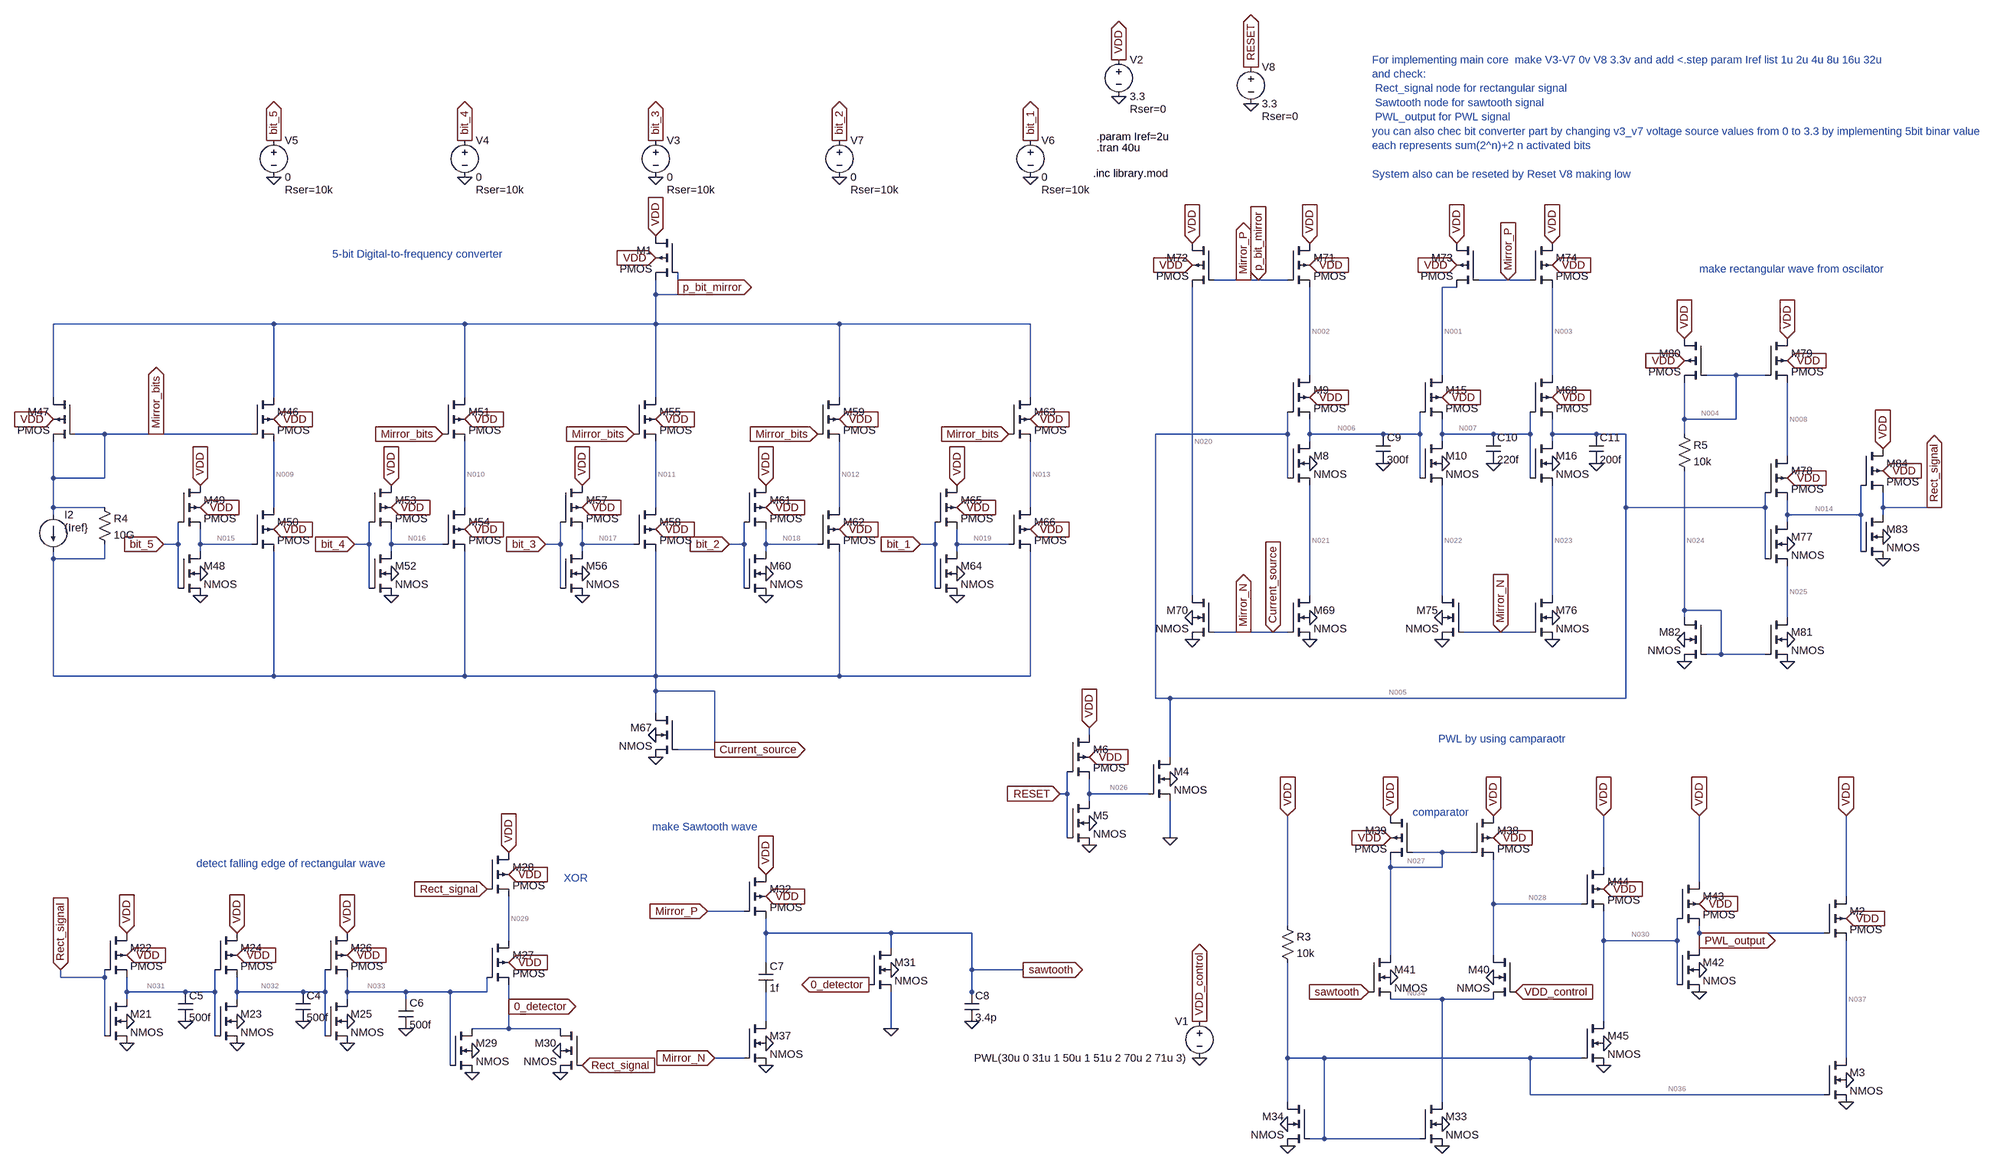
[diagram p0: schematic final_pwl_ready_with_5_bit_converter_with_reset.asc]
final_pwl_ready_with_5_bit_converter_with_reset.asc, the LTspice schematic file:
Version 4
SHEET 1 4352 2900
WIRE -288 288 -352 288
WIRE -256 288 -288 288
WIRE -192 288 -256 288
WIRE 288 288 224 288
WIRE 336 288 288 288
WIRE -1520 304 -1520 272
WIRE 176 304 144 304
WIRE -1568 320 -1568 288
WIRE -1520 320 -1520 304
WIRE -1520 320 -1568 320
WIRE -2400 384 -2880 384
WIRE -1984 384 -2400 384
WIRE -1568 384 -1568 320
WIRE -1568 384 -1984 384
WIRE -1168 384 -1568 384
WIRE -752 384 -1168 384
WIRE -144 496 -144 304
WIRE 144 496 144 304
WIRE 384 496 384 304
WIRE 784 496 720 496
WIRE 848 496 784 496
WIRE -2880 544 -2880 384
WIRE -2400 544 -2400 384
WIRE -1984 544 -1984 384
WIRE -1568 544 -1568 384
WIRE -1168 544 -1168 384
WIRE -752 544 -752 384
WIRE 672 592 672 512
WIRE 784 592 784 496
WIRE 784 592 672 592
WIRE -2768 624 -2832 624
WIRE -2656 624 -2768 624
WIRE -2448 624 -2656 624
WIRE -192 624 -192 576
WIRE -192 624 -480 624
WIRE -144 624 -144 592
WIRE 16 624 -144 624
WIRE 96 624 96 576
WIRE 96 624 16 624
WIRE 144 624 144 592
WIRE 256 624 144 624
WIRE 336 624 336 576
WIRE 336 624 256 624
WIRE 384 624 384 592
WIRE 480 624 384 624
WIRE 544 624 480 624
WIRE 672 624 672 592
WIRE -144 640 -144 624
WIRE 144 640 144 624
WIRE 384 640 384 624
WIRE 896 672 896 512
WIRE -2880 720 -2880 640
WIRE -2768 720 -2768 624
WIRE -2768 720 -2880 720
WIRE -192 720 -192 624
WIRE 96 720 96 624
WIRE 336 720 336 624
WIRE -2880 784 -2880 720
WIRE -2768 784 -2880 784
WIRE -2400 784 -2400 640
WIRE -1984 784 -1984 640
WIRE -1568 784 -1568 640
WIRE -1168 784 -1168 640
WIRE -752 784 -752 640
WIRE 544 784 544 624
WIRE 848 784 848 752
WIRE 848 784 544 784
WIRE 1104 784 1104 752
WIRE 1216 784 1104 784
WIRE 1232 784 1216 784
WIRE -2880 800 -2880 784
WIRE 896 800 896 768
WIRE 1056 800 1056 736
WIRE 1056 800 896 800
WIRE 1104 800 1104 784
WIRE 896 816 896 800
WIRE -2608 864 -2608 816
WIRE -2608 864 -2640 864
WIRE -2560 864 -2560 832
WIRE -2448 864 -2560 864
WIRE -2192 864 -2192 816
WIRE -2192 864 -2224 864
WIRE -2144 864 -2144 832
WIRE -2032 864 -2144 864
WIRE -1776 864 -1776 816
WIRE -1776 864 -1808 864
WIRE -1728 864 -1728 832
WIRE -1616 864 -1728 864
WIRE -1376 864 -1376 816
WIRE -1376 864 -1408 864
WIRE -1328 864 -1328 832
WIRE -1216 864 -1328 864
WIRE -960 864 -960 816
WIRE -960 864 -992 864
WIRE -912 864 -912 832
WIRE -800 864 -912 864
WIRE -2560 880 -2560 864
WIRE -2144 880 -2144 864
WIRE -1728 880 -1728 864
WIRE -1328 880 -1328 864
WIRE -912 880 -912 864
WIRE 1056 880 1056 800
WIRE -2880 896 -2880 880
WIRE -2768 896 -2768 864
WIRE -2768 896 -2880 896
WIRE 848 896 848 784
WIRE -2608 960 -2608 864
WIRE -2192 960 -2192 864
WIRE -1776 960 -1776 864
WIRE -1376 960 -1376 864
WIRE -960 960 -960 864
WIRE -400 976 -400 304
WIRE -144 976 -144 736
WIRE 144 976 144 736
WIRE 384 976 384 736
WIRE 672 1008 672 704
WIRE 752 1008 672 1008
WIRE 672 1024 672 1008
WIRE 896 1024 896 912
WIRE -288 1056 -352 1056
WIRE -224 1056 -288 1056
WIRE -192 1056 -224 1056
WIRE 272 1056 192 1056
WIRE 336 1056 272 1056
WIRE 752 1104 752 1008
WIRE 752 1104 720 1104
WIRE 848 1104 752 1104
WIRE -2880 1152 -2880 896
WIRE -2400 1152 -2400 880
WIRE -2400 1152 -2880 1152
WIRE -1984 1152 -1984 880
WIRE -1984 1152 -2400 1152
WIRE -1568 1152 -1568 880
WIRE -1568 1152 -1984 1152
WIRE -1168 1152 -1168 880
WIRE -1168 1152 -1568 1152
WIRE -752 1152 -752 880
WIRE -752 1152 -1168 1152
WIRE -1568 1184 -1568 1152
WIRE -1440 1184 -1568 1184
WIRE -480 1200 -480 624
WIRE -448 1200 -480 1200
WIRE 544 1200 544 784
WIRE 544 1200 -448 1200
WIRE -1568 1232 -1568 1184
WIRE -624 1280 -624 1264
WIRE -1440 1312 -1440 1184
WIRE -1440 1312 -1520 1312
WIRE -448 1328 -448 1200
WIRE -672 1408 -672 1360
WIRE -672 1408 -688 1408
WIRE -624 1408 -624 1376
WIRE -496 1408 -624 1408
WIRE -624 1424 -624 1408
WIRE -672 1504 -672 1408
WIRE -448 1504 -448 1424
WIRE 144 1536 80 1536
WIRE 208 1536 144 1536
WIRE 32 1568 32 1552
WIRE 144 1568 144 1536
WIRE 144 1568 32 1568
WIRE 496 1568 496 1456
WIRE 704 1600 704 1456
WIRE 1024 1632 1024 1456
WIRE 256 1648 256 1552
WIRE 448 1648 256 1648
WIRE -1376 1664 -1456 1664
WIRE -192 1696 -192 1456
WIRE -1328 1712 -1328 1680
WIRE -1056 1712 -1328 1712
WIRE -880 1712 -1056 1712
WIRE 704 1712 704 1696
WIRE 976 1712 704 1712
WIRE -1888 1728 -1888 1632
WIRE 496 1728 496 1664
WIRE 656 1728 656 1680
WIRE 656 1728 496 1728
WIRE 704 1728 704 1712
WIRE -1056 1744 -1056 1712
WIRE 704 1744 704 1728
WIRE 32 1760 32 1568
WIRE 256 1760 256 1648
WIRE -1328 1776 -1328 1712
WIRE -880 1792 -880 1712
WIRE -768 1792 -880 1792
WIRE -2864 1808 -2864 1792
WIRE -2768 1808 -2768 1792
WIRE -2768 1808 -2864 1808
WIRE 656 1824 656 1728
WIRE -2720 1840 -2720 1808
WIRE -2592 1840 -2720 1840
WIRE -2528 1840 -2528 1792
WIRE -2528 1840 -2592 1840
WIRE -2480 1840 -2480 1808
WIRE -2336 1840 -2480 1840
WIRE -2288 1840 -2288 1792
WIRE -2288 1840 -2336 1840
WIRE -2240 1840 -2240 1808
WIRE -2112 1840 -2240 1840
WIRE -2016 1840 -2112 1840
WIRE -1936 1840 -1936 1808
WIRE -1936 1840 -2016 1840
WIRE -880 1840 -880 1792
WIRE -2720 1856 -2720 1840
WIRE -2480 1856 -2480 1840
WIRE -2240 1856 -2240 1840
WIRE -2112 1856 -2112 1840
WIRE -880 1856 -880 1840
WIRE 144 1856 32 1856
WIRE 256 1856 144 1856
WIRE -1888 1872 -1888 1824
WIRE -1328 1904 -1328 1840
WIRE 496 1904 496 1728
WIRE -1888 1920 -1888 1872
WIRE -1888 1920 -1968 1920
WIRE -1776 1920 -1888 1920
WIRE -1056 1920 -1056 1840
WIRE -2768 1936 -2768 1808
WIRE -2528 1936 -2528 1840
WIRE -2288 1936 -2288 1840
WIRE -1376 1984 -1440 1984
WIRE -192 1984 -192 1776
WIRE -112 1984 -192 1984
WIRE 336 1984 -112 1984
WIRE 448 1984 336 1984
WIRE 1024 1984 1024 1728
WIRE -2016 2000 -2016 1840
WIRE 336 2064 336 1984
WIRE 976 2064 336 2064
WIRE -192 2080 -192 1984
WIRE 144 2080 144 1856
WIRE -112 2160 -112 1984
WIRE -112 2160 -144 2160
WIRE 96 2160 -112 2160
FLAG -560 -112 0
FLAG -560 -192 VDD
IOPIN -560 -192 Out
FLAG -2720 1904 0
FLAG -2480 1904 0
FLAG -2240 1904 0
FLAG -2240 1760 VDD
IOPIN -2240 1760 In
FLAG -2480 1760 VDD
IOPIN -2480 1760 In
FLAG -2720 1760 VDD
IOPIN -2720 1760 In
FLAG -2864 1792 Rect_signal
IOPIN -2864 1792 In
FLAG -2240 1952 0
FLAG -2480 1952 0
FLAG -2720 1952 0
FLAG -2720 1712 VDD
IOPIN -2720 1712 In
FLAG -2480 1712 VDD
IOPIN -2480 1712 In
FLAG -2240 1712 VDD
IOPIN -2240 1712 In
FLAG -2112 1920 0
FLAG -2336 1904 0
FLAG -2592 1904 0
FLAG -1936 1616 Rect_signal
IOPIN -1936 1616 In
FLAG -1968 1968 0
FLAG -1776 1968 0
FLAG -1776 2016 0
FLAG -1888 1584 VDD
IOPIN -1888 1584 In
FLAG -1888 1536 VDD
IOPIN -1888 1536 In
FLAG -1728 2000 Rect_signal
IOPIN -1728 2000 In
FLAG -1888 1776 VDD
IOPIN -1888 1776 In
FLAG -1968 2016 0
FLAG -1888 1872 0_detector
IOPIN -1888 1872 Out
FLAG -1104 1824 0_detector
IOPIN -1104 1824 Out
FLAG -1328 1584 VDD
IOPIN -1328 1584 In
FLAG -1328 1632 VDD
IOPIN -1328 1632 In
FLAG -1056 1920 0
FLAG -880 1904 0
FLAG -1056 1792 0
FLAG -768 1792 sawtooth
IOPIN -768 1792 Out
FLAG -1328 2000 0
FLAG -1328 1952 0
FLAG -1440 1984 Mirror_N
IOPIN -1440 1984 In
FLAG -1456 1664 Mirror_P
IOPIN -1456 1664 In
FLAG -16 1840 sawtooth
IOPIN -16 1840 In
FLAG -384 1984 0
FLAG 32 1456 VDD
IOPIN 32 1456 In
FLAG 256 1456 VDD
IOPIN 256 1456 In
FLAG 256 1504 VDD
IOPIN 256 1504 In
FLAG 32 1504 VDD
IOPIN 32 1504 In
FLAG 256 1808 0
FLAG 32 1808 0
FLAG -192 1456 VDD
IOPIN -192 1456 In
FLAG -192 2176 0
FLAG -192 2128 0
FLAG 144 2176 0
FLAG 144 2128 0
FLAG -384 1904 VDD_control
IOPIN -384 1904 Out
FLAG 304 1840 VDD_control
IOPIN 304 1840 In
FLAG 496 1456 VDD
IOPIN 496 1456 In
FLAG 496 1616 VDD
IOPIN 496 1616 In
FLAG 496 2000 0
FLAG 496 1952 0
FLAG 704 1792 0
FLAG 704 1648 VDD
IOPIN 704 1648 In
FLAG 704 1456 VDD
IOPIN 704 1456 In
FLAG 704 1840 0
FLAG 704 1728 PWL_output
IOPIN 704 1728 Out
FLAG -752 -16 bit_1
IOPIN -752 -16 Out
FLAG -1168 -16 bit_2
IOPIN -1168 -16 Out
FLAG -1568 -16 bit_3
IOPIN -1568 -16 Out
FLAG -1984 -16 bit_4
IOPIN -1984 -16 Out
FLAG -2400 -16 bit_5
IOPIN -2400 -16 Out
FLAG -752 64 0
FLAG -1168 64 0
FLAG -1568 64 0
FLAG -1984 64 0
FLAG -2400 64 0
FLAG -2400 592 VDD
IOPIN -2400 592 In
FLAG -2880 592 VDD
IOPIN -2880 592 In
FLAG -2560 928 0
FLAG -2560 784 VDD
IOPIN -2560 784 In
FLAG -2560 736 VDD
IOPIN -2560 736 In
FLAG -2560 976 0
FLAG -2400 832 VDD
IOPIN -2400 832 In
FLAG -2640 864 bit_5
IOPIN -2640 864 In
FLAG -1984 592 VDD
IOPIN -1984 592 In
FLAG -2144 928 0
FLAG -2144 784 VDD
IOPIN -2144 784 In
FLAG -2144 736 VDD
IOPIN -2144 736 In
FLAG -2144 976 0
FLAG -1984 832 VDD
IOPIN -1984 832 In
FLAG -2224 864 bit_4
IOPIN -2224 864 In
FLAG -1568 592 VDD
IOPIN -1568 592 In
FLAG -1728 928 0
FLAG -1728 784 VDD
IOPIN -1728 784 In
FLAG -1728 736 VDD
IOPIN -1728 736 In
FLAG -1728 976 0
FLAG -1568 832 VDD
IOPIN -1568 832 In
FLAG -1808 864 bit_3
IOPIN -1808 864 In
FLAG -1168 592 VDD
IOPIN -1168 592 In
FLAG -1328 928 0
FLAG -1328 784 VDD
IOPIN -1328 784 In
FLAG -1328 736 VDD
IOPIN -1328 736 In
FLAG -1328 976 0
FLAG -1168 832 VDD
IOPIN -1168 832 In
FLAG -1408 864 bit_2
IOPIN -1408 864 In
FLAG -752 592 VDD
IOPIN -752 592 In
FLAG -912 928 0
FLAG -912 784 VDD
IOPIN -912 784 In
FLAG -912 736 VDD
IOPIN -912 736 In
FLAG -912 976 0
FLAG -752 832 VDD
IOPIN -752 832 In
FLAG -992 864 bit_1
IOPIN -992 864 In
FLAG -2656 624 Mirror_bits
IOPIN -2656 624 Out
FLAG -2032 624 Mirror_bits
IOPIN -2032 624 In
FLAG -1616 624 Mirror_bits
IOPIN -1616 624 In
FLAG -1216 624 Mirror_bits
IOPIN -1216 624 In
FLAG -800 624 Mirror_bits
IOPIN -800 624 In
FLAG -1568 1280 0
FLAG -1568 1328 0
FLAG -1440 1312 Current_source
IOPIN -1440 1312 Out
FLAG -144 688 0
FLAG 144 688 0
FLAG 384 688 0
FLAG -400 1072 0
FLAG -144 1072 0
FLAG -144 1024 0
FLAG -400 1024 0
FLAG 384 544 VDD
IOPIN 384 544 In
FLAG 144 544 VDD
IOPIN 144 544 In
FLAG -400 208 VDD
IOPIN -400 208 In
FLAG -144 208 VDD
IOPIN -144 208 In
FLAG -144 256 VDD
IOPIN -144 256 In
FLAG -400 256 VDD
IOPIN -400 256 In
FLAG -144 544 VDD
IOPIN -144 544 In
FLAG 176 208 VDD
IOPIN 176 208 In
FLAG 176 256 VDD
IOPIN 176 256 In
FLAG 384 208 VDD
IOPIN 384 208 In
FLAG 384 256 VDD
IOPIN 384 256 In
FLAG 144 1072 0
FLAG 144 1024 0
FLAG 384 1072 0
FLAG 384 1024 0
FLAG -288 288 Mirror_P
IOPIN -288 288 Out
FLAG -288 1056 Mirror_N
IOPIN -288 1056 Out
FLAG 288 288 Mirror_P
IOPIN 288 288 In
FLAG 272 1056 Mirror_N
IOPIN 272 1056 In
FLAG 896 864 0
FLAG 896 720 VDD
IOPIN 896 720 In
FLAG 672 416 VDD
IOPIN 672 416 In
FLAG 896 416 VDD
IOPIN 896 416 In
FLAG 896 464 VDD
IOPIN 896 464 In
FLAG 672 464 VDD
IOPIN 672 464 In
FLAG 672 1120 0
FLAG 896 1120 0
FLAG 896 1072 0
FLAG 672 1072 0
FLAG 1104 848 0
FLAG 1104 704 VDD
IOPIN 1104 704 In
FLAG 1104 656 VDD
IOPIN 1104 656 In
FLAG 1104 896 0
FLAG 16 688 0
FLAG 480 688 0
FLAG 256 688 0
FLAG 1216 784 Rect_signal
IOPIN 1216 784 Out
FLAG -1568 192 VDD
IOPIN -1568 192 In
FLAG -1568 240 VDD
IOPIN -1568 240 In
FLAG -1520 304 p_bit_mirror
IOPIN -1520 304 Out
FLAG -256 288 p_bit_mirror
IOPIN -256 288 In
FLAG -224 1056 Current_source
IOPIN -224 1056 In
FLAG 1024 1456 VDD
IOPIN 1024 1456 In
FLAG 1024 1680 VDD
IOPIN 1024 1680 In
FLAG 1024 2080 0
FLAG 1024 2032 0
FLAG -272 -96 0
FLAG -272 -176 RESET
IOPIN -272 -176 Out
FLAG -688 1408 RESET
IOPIN -688 1408 In
FLAG -448 1504 0
FLAG -624 1472 0
FLAG -624 1328 VDD
IOPIN -624 1328 In
FLAG -624 1264 VDD
IOPIN -624 1264 In
FLAG -624 1520 0
FLAG -448 1376 0
SYMBOL voltage -560 -208 R0
WINDOW 123 0 0 Left 0
WINDOW 39 24 124 Left 2
SYMATTR SpiceLine Rser=0
SYMATTR InstName V2
SYMATTR Value 3.3
SYMBOL nmos4 -2768 1856 R0
SYMATTR InstName M21
SYMATTR Value2 l=0.35u w=0.4u
SYMBOL pmos4 -2768 1712 R0
SYMATTR InstName M22
SYMATTR Value2 l=0.35u w=0.8u
SYMBOL nmos4 -2528 1856 R0
SYMATTR InstName M23
SYMATTR Value2 l=1.05u w=1.2u
SYMBOL pmos4 -2528 1712 R0
SYMATTR InstName M24
SYMATTR Value2 l=1.05u w=2.4u
SYMBOL nmos4 -2288 1856 R0
SYMATTR InstName M25
SYMATTR Value2 l=3.15u w=3.6u
SYMBOL pmos4 -2288 1712 R0
SYMATTR InstName M26
SYMATTR Value2 l=3.15u w=7.2u
SYMBOL cap -2352 1840 R0
SYMATTR InstName C4
SYMATTR Value 500f
SYMBOL cap -2608 1840 R0
SYMATTR InstName C5
SYMATTR Value 500f
SYMBOL cap -2128 1856 R0
SYMATTR InstName C6
SYMATTR Value 500f
SYMBOL pmos4 -1936 1728 R0
SYMATTR InstName M27
SYMATTR Value2 l=0.35u w=0.8u
SYMBOL pmos4 -1936 1536 R0
SYMATTR InstName M28
SYMATTR Value2 l=0.35u w=0.8u
SYMBOL nmos4 -2016 1920 R0
SYMATTR InstName M29
SYMATTR Value2 l=0.35u w=0.4u
SYMBOL nmos4 -1728 1920 M0
SYMATTR InstName M30
SYMATTR Value2 l=0.35u w=0.4u
SYMBOL pmos4 -1376 1584 R0
SYMATTR InstName M32
SYMATTR Value2 l=2u w=80u
SYMBOL cap -1344 1776 R0
SYMATTR InstName C7
SYMATTR Value 1f
SYMBOL cap -896 1840 R0
SYMATTR InstName C8
SYMATTR Value 3.4p
SYMBOL nmos4 -1104 1744 R0
SYMATTR InstName M31
SYMATTR Value2 l=0.35u w=15u
SYMBOL nmos4 -1376 1904 R0
SYMATTR InstName M37
SYMATTR Value2 l=2u w=40u
SYMBOL voltage -384 1888 M0
WINDOW 123 0 0 Left 0
WINDOW 39 0 0 Left 0
SYMATTR InstName V1
SYMATTR Value PWL(30u 0 31u 1 50u 1 51u 2 70u 2 71u 3)
SYMBOL pmos4 208 1456 R0
SYMATTR InstName M38
SYMATTR Value2 l=0.35u w=2.8u
SYMBOL pmos4 80 1456 M0
SYMATTR InstName M39
SYMATTR Value2 l=0.35u w=2.8u
SYMBOL nmos4 304 1760 M0
SYMATTR InstName M40
SYMATTR Value2 l=0.35u w=1.4u
SYMBOL nmos4 -16 1760 R0
SYMATTR InstName M41
SYMATTR Value2 l=0.35u w=1.4u
SYMBOL nmos4 -144 2080 M0
SYMATTR InstName M34
SYMATTR Value2 l=0.35u w=1.4u
SYMBOL res -208 1680 R0
SYMATTR InstName R3
SYMATTR Value 10k
SYMBOL nmos4 96 2080 R0
SYMATTR InstName M33
SYMATTR Value2 l=0.35u w=3u
SYMBOL pmos4 448 1568 R0
SYMATTR InstName M44
SYMATTR Value2 l=0.35u w=2.8u
SYMBOL nmos4 448 1904 R0
SYMATTR InstName M45
SYMATTR Value2 l=0.35u w=1.4u
SYMBOL nmos4 656 1744 R0
SYMATTR InstName M42
SYMATTR Value2 l=0.35u w=1u
SYMBOL pmos4 656 1600 R0
SYMATTR InstName M43
SYMATTR Value2 l=0.35u w=2.4u
SYMBOL voltage -752 -32 R0
WINDOW 123 0 0 Left 0
WINDOW 39 24 124 Left 2
SYMATTR SpiceLine Rser=10k
SYMATTR InstName V6
SYMATTR Value 0
SYMBOL voltage -1168 -32 R0
WINDOW 123 0 0 Left 0
WINDOW 39 24 124 Left 2
SYMATTR SpiceLine Rser=10k
SYMATTR InstName V7
SYMATTR Value 0
SYMBOL voltage -1568 -32 R0
WINDOW 123 0 0 Left 0
WINDOW 39 24 124 Left 2
SYMATTR SpiceLine Rser=10k
SYMATTR InstName V3
SYMATTR Value 0
SYMBOL voltage -1984 -32 R0
WINDOW 123 0 0 Left 0
WINDOW 39 24 124 Left 2
SYMATTR SpiceLine Rser=10k
SYMATTR InstName V4
SYMATTR Value 0
SYMBOL voltage -2400 -32 R0
WINDOW 123 0 0 Left 0
WINDOW 39 24 124 Left 2
SYMATTR SpiceLine Rser=10k
SYMATTR InstName V5
SYMATTR Value 0
SYMBOL current -2880 800 R0
WINDOW 123 0 0 Left 0
WINDOW 39 0 0 Left 0
WINDOW 3 24 28 Left 2
SYMATTR Value {Iref}
SYMATTR InstName I2
SYMBOL res -2784 768 R0
SYMATTR InstName R4
SYMATTR Value 10G
SYMBOL pmos4 -2448 544 R0
SYMATTR InstName M46
SYMATTR Value2 l=0.5u w=11.5u
SYMBOL pmos4 -2832 544 M0
SYMATTR InstName M47
SYMATTR Value2 l=0.5u w=2u
SYMBOL nmos4 -2608 880 R0
SYMATTR InstName M48
SYMATTR Value2 l=0.35u w=1u
SYMBOL pmos4 -2608 736 R0
SYMATTR InstName M49
SYMATTR Value2 l=0.35u w=2.4u
SYMBOL pmos4 -2448 784 R0
SYMATTR InstName M50
SYMATTR Value2 l=0.5u w=22.4u
SYMBOL pmos4 -2032 544 R0
SYMATTR InstName M51
SYMATTR Value2 l=0.5u w=6.1u
SYMBOL nmos4 -2192 880 R0
SYMATTR InstName M52
SYMATTR Value2 l=0.35u w=1u
SYMBOL pmos4 -2192 736 R0
SYMATTR InstName M53
SYMATTR Value2 l=0.35u w=2.4u
SYMBOL pmos4 -2032 784 R0
SYMATTR InstName M54
SYMATTR Value2 l=0.5u w=11.2u
SYMBOL pmos4 -1616 544 R0
SYMATTR InstName M55
SYMATTR Value2 l=0.5u w=3.1u
SYMBOL nmos4 -1776 880 R0
SYMATTR InstName M56
SYMATTR Value2 l=0.35u w=1u
SYMBOL pmos4 -1776 736 R0
SYMATTR InstName M57
SYMATTR Value2 l=0.35u w=2.4u
SYMBOL pmos4 -1616 784 R0
SYMATTR InstName M58
SYMATTR Value2 l=0.5u w=5.6u
SYMBOL pmos4 -1216 544 R0
SYMATTR InstName M59
SYMATTR Value2 l=0.5u w=1.6u
SYMBOL nmos4 -1376 880 R0
SYMATTR InstName M60
SYMATTR Value2 l=0.35u w=1u
SYMBOL pmos4 -1376 736 R0
SYMATTR InstName M61
SYMATTR Value2 l=0.35u w=2.4u
SYMBOL pmos4 -1216 784 R0
SYMATTR InstName M62
SYMATTR Value2 l=0.5u w=2.8u
SYMBOL pmos4 -800 544 R0
SYMATTR InstName M63
SYMATTR Value2 l=0.5u w=1u
SYMBOL nmos4 -960 880 R0
SYMATTR InstName M64
SYMATTR Value2 l=0.35u w=1u
SYMBOL pmos4 -960 736 R0
SYMATTR InstName M65
SYMATTR Value2 l=0.35u w=2.4u
SYMBOL pmos4 -800 784 R0
SYMATTR InstName M66
SYMATTR Value2 l=0.5u w=1.4u
SYMBOL nmos4 -1520 1232 M0
SYMATTR InstName M67
SYMATTR Value2 l=0.35u w=1.4u
SYMBOL nmos4 -192 640 R0
SYMATTR InstName M8
SYMATTR Value2 l=0.35u w=1u
SYMBOL pmos4 -192 496 R0
SYMATTR InstName M9
SYMATTR Value2 l=0.35u w=2.4u
SYMBOL nmos4 96 640 R0
SYMATTR InstName M10
SYMATTR Value2 l=0.35u w=1u
SYMBOL pmos4 96 496 R0
SYMATTR InstName M15
SYMATTR Value2 l=0.35u w=2.4u
SYMBOL nmos4 336 640 R0
SYMATTR InstName M16
SYMATTR Value2 l=0.35u w=1u
SYMBOL pmos4 336 496 R0
SYMATTR InstName M68
SYMATTR Value2 l=0.35u w=2.4u
SYMBOL nmos4 -192 976 R0
SYMATTR InstName M69
SYMATTR Value2 l=0.35u w=1.4u
SYMBOL nmos4 -352 976 M0
SYMATTR InstName M70
SYMATTR Value2 l=0.35u w=1.4u
SYMBOL pmos4 -192 208 R0
SYMATTR InstName M71
SYMATTR Value2 l=0.35u w=2.8u
SYMBOL pmos4 -352 208 M0
SYMATTR InstName M72
SYMATTR Value2 l=0.35u w=2.8u
SYMBOL pmos4 224 208 M0
SYMATTR InstName M73
SYMATTR Value2 l=0.35u w=6u
SYMBOL pmos4 336 208 R0
SYMATTR InstName M74
SYMATTR Value2 l=0.35u w=6u
SYMBOL nmos4 192 976 M0
SYMATTR InstName M75
SYMATTR Value2 l=0.35u w=1.8u
SYMBOL nmos4 336 976 R0
SYMATTR InstName M76
SYMATTR Value2 l=0.35u w=1.8u
SYMBOL nmos4 848 816 R0
SYMATTR InstName M77
SYMATTR Value2 l=0.35u w=1u
SYMBOL pmos4 848 672 R0
SYMATTR InstName M78
SYMATTR Value2 l=0.35u w=2.4u
SYMBOL pmos4 848 416 R0
SYMATTR InstName M79
SYMATTR Value2 l=0.35u w=2.8u
SYMBOL pmos4 720 416 M0
SYMATTR InstName M80
SYMATTR Value2 l=0.35u w=2.8u
SYMBOL nmos4 848 1024 R0
SYMATTR InstName M81
SYMATTR Value2 l=0.35u w=1.4u
SYMBOL nmos4 720 1024 M0
SYMATTR InstName M82
SYMATTR Value2 l=0.35u w=1.4u
SYMBOL res 656 608 R0
SYMATTR InstName R5
SYMATTR Value 10k
SYMBOL nmos4 1056 800 R0
SYMATTR InstName M83
SYMATTR Value2 l=0.35u w=1u
SYMBOL pmos4 1056 656 R0
SYMATTR InstName M84
SYMATTR Value2 l=0.35u w=2.4u
SYMBOL cap 0 624 R0
SYMATTR InstName C9
SYMATTR Value 300f
SYMBOL cap 240 624 R0
SYMATTR InstName C10
SYMATTR Value 220f
SYMBOL cap 464 624 R0
SYMATTR InstName C11
SYMATTR Value 200f
SYMBOL pmos4 -1520 192 M0
SYMATTR InstName M1
SYMATTR Value2 l=0.35u w=2.8u
SYMBOL pmos4 976 1632 R0
SYMATTR InstName M2
SYMATTR Value2 l=0.35u w=2.8u
SYMBOL nmos4 976 1984 R0
SYMATTR InstName M3
SYMATTR Value2 l=0.35u w=1.4u
SYMBOL voltage -272 -192 R0
WINDOW 123 0 0 Left 0
WINDOW 39 24 124 Left 2
SYMATTR SpiceLine Rser=0
SYMATTR InstName V8
SYMATTR Value 3.3
SYMBOL nmos4 -672 1424 R0
SYMATTR InstName M5
SYMATTR Value2 l=0.35u w=1u
SYMBOL pmos4 -672 1280 R0
SYMATTR InstName M6
SYMATTR Value2 l=0.35u w=2.4u
SYMBOL nmos4 -496 1328 R0
SYMATTR InstName M4
TEXT -616 56 Left 2 !.inc library.mod
TEXT -608 -24 Left 2 !.param Iref=2u
TEXT -608 0 Left 2 !.tran 40u
TEXT -2568 1560 Left 2 ;detect falling edge of rectangular wave
TEXT -1576 1480 Left 2 ;make Sawtooth wave
TEXT -1768 1592 Left 2 ;XOR
TEXT 136 1288 Left 2 ;PWL by using camparaotr
TEXT -2272 232 Left 2 ;5-bit Digital-to-frequency converter
TEXT 80 1448 Left 2 ;comparator
TEXT 704 264 Left 2 ;make rectangular wave from oscilator
TEXT -8 -192 Left 2 ;For implementing main core  make V3-V7 0v V8 3.3v and add <.step param Iref list 1u 2u 4u 8u 16u 32u\nand check:\n Rect_signal node for rectangular signal \n Sawtooth node for sawtooth signal\n PWL_output for PWL signal \nyou can also chec bit converter part by changing v3_v7 voltage source values from 0 to 3.3 by implementing 5bit binar value \neach represents sum(2^n)+2 n activated bits\n \nSystem also can be reseted by Reset V8 making low

The netlist it stands for:
* final_pwl_ready_with_5_bit_converter_with_reset.asc
V2 VDD 0 3.3 Rser=0
M21 N031 Rect_signal 0 0 NMOS l=0.35u w=0.4u
M22 VDD Rect_signal N031 VDD PMOS l=0.35u w=0.8u
M23 N032 N031 0 0 NMOS l=1.05u w=1.2u
M24 VDD N031 N032 VDD PMOS l=1.05u w=2.4u
M25 N033 N032 0 0 NMOS l=3.15u w=3.6u
M26 VDD N032 N033 VDD PMOS l=3.15u w=7.2u
C4 N032 0 500f
C5 N031 0 500f
C6 N033 0 500f
M27 N029 N033 0_detector VDD PMOS l=0.35u w=0.8u
M28 VDD Rect_signal N029 VDD PMOS l=0.35u w=0.8u
M29 0_detector N033 0 0 NMOS l=0.35u w=0.4u
M30 0_detector Rect_signal 0 0 NMOS l=0.35u w=0.4u
M32 VDD p_bit_mirror sawtooth VDD PMOS l=2u w=80u
C7 sawtooth N035 1f
C8 sawtooth 0 3.4p
M31 sawtooth 0_detector 0 0 NMOS l=0.35u w=15u
M37 N035 Current_source 0 0 NMOS l=2u w=40u
V1 VDD_control 0 PWL(30u 0 31u 1 50u 1 51u 2 70u 2 71u 3)
M38 VDD N027 N028 VDD PMOS l=0.35u w=2.8u
M39 VDD N027 N027 VDD PMOS l=0.35u w=2.8u
M40 N028 VDD_control N034 0 NMOS l=0.35u w=1.4u
M41 N027 sawtooth N034 0 NMOS l=0.35u w=1.4u
M34 N036 N036 0 0 NMOS l=0.35u w=1.4u
R3 VDD N036 10k
M33 N034 N036 0 0 NMOS l=0.35u w=3u
M44 VDD N028 N030 VDD PMOS l=0.35u w=2.8u
M45 N030 N036 0 0 NMOS l=0.35u w=1.4u
M42 PWL_output N030 0 0 NMOS l=0.35u w=1u
M43 VDD N030 PWL_output VDD PMOS l=0.35u w=2.4u
V6 bit_1 0 0 Rser=10k
V7 bit_2 0 0 Rser=10k
V3 bit_3 0 0 Rser=10k
V4 bit_4 0 0 Rser=10k
V5 bit_5 0 0 Rser=10k
I2 Mirror_bits Current_source {Iref}
R4 Mirror_bits Current_source 10G
M46 p_bit_mirror Mirror_bits N009 VDD PMOS l=0.5u w=11.5u
M47 p_bit_mirror Mirror_bits Mirror_bits VDD PMOS l=0.5u w=2u
M48 N015 bit_5 0 0 NMOS l=0.35u w=1u
M49 VDD bit_5 N015 VDD PMOS l=0.35u w=2.4u
M50 N009 N015 Current_source VDD PMOS l=0.5u w=22.4u
M51 p_bit_mirror Mirror_bits N010 VDD PMOS l=0.5u w=6.1u
M52 N016 bit_4 0 0 NMOS l=0.35u w=1u
M53 VDD bit_4 N016 VDD PMOS l=0.35u w=2.4u
M54 N010 N016 Current_source VDD PMOS l=0.5u w=11.2u
M55 p_bit_mirror Mirror_bits N011 VDD PMOS l=0.5u w=3.1u
M56 N017 bit_3 0 0 NMOS l=0.35u w=1u
M57 VDD bit_3 N017 VDD PMOS l=0.35u w=2.4u
M58 N011 N017 Current_source VDD PMOS l=0.5u w=5.6u
M59 p_bit_mirror Mirror_bits N012 VDD PMOS l=0.5u w=1.6u
M60 N018 bit_2 0 0 NMOS l=0.35u w=1u
M61 VDD bit_2 N018 VDD PMOS l=0.35u w=2.4u
M62 N012 N018 Current_source VDD PMOS l=0.5u w=2.8u
M63 p_bit_mirror Mirror_bits N013 VDD PMOS l=0.5u w=1u
M64 N019 bit_1 0 0 NMOS l=0.35u w=1u
M65 VDD bit_1 N019 VDD PMOS l=0.35u w=2.4u
M66 N013 N019 Current_source VDD PMOS l=0.5u w=1.4u
M67 Current_source Current_source 0 0 NMOS l=0.35u w=1.4u
M8 N006 N005 N021 0 NMOS l=0.35u w=1u
M9 N002 N005 N006 VDD PMOS l=0.35u w=2.4u
M10 N007 N006 N022 0 NMOS l=0.35u w=1u
M15 N001 N006 N007 VDD PMOS l=0.35u w=2.4u
M16 N005 N007 N023 0 NMOS l=0.35u w=1u
M68 N003 N007 N005 VDD PMOS l=0.35u w=2.4u
M69 N021 Current_source 0 0 NMOS l=0.35u w=1.4u
M70 N020 Current_source 0 0 NMOS l=0.35u w=1.4u
M71 VDD p_bit_mirror N002 VDD PMOS l=0.35u w=2.8u
M72 VDD p_bit_mirror N020 VDD PMOS l=0.35u w=2.8u
M73 VDD p_bit_mirror N001 VDD PMOS l=0.35u w=6u
M74 VDD p_bit_mirror N003 VDD PMOS l=0.35u w=6u
M75 N022 Current_source 0 0 NMOS l=0.35u w=1.8u
M76 N023 Current_source 0 0 NMOS l=0.35u w=1.8u
M77 N014 N005 N025 0 NMOS l=0.35u w=1u
M78 N008 N005 N014 VDD PMOS l=0.35u w=2.4u
M79 VDD N004 N008 VDD PMOS l=0.35u w=2.8u
M80 VDD N004 N004 VDD PMOS l=0.35u w=2.8u
M81 N025 N024 0 0 NMOS l=0.35u w=1.4u
M82 N024 N024 0 0 NMOS l=0.35u w=1.4u
R5 N004 N024 10k
M83 Rect_signal N014 0 0 NMOS l=0.35u w=1u
M84 VDD N014 Rect_signal VDD PMOS l=0.35u w=2.4u
C9 N006 0 300f
C10 N007 0 220f
C11 N005 0 200f
M1 VDD p_bit_mirror p_bit_mirror VDD PMOS l=0.35u w=2.8u
M2 VDD PWL_output N037 VDD PMOS l=0.35u w=2.8u
M3 N037 N036 0 0 NMOS l=0.35u w=1.4u
V8 RESET 0 3.3 Rser=0
M5 N026 RESET 0 0 NMOS l=0.35u w=1u
M6 VDD RESET N026 VDD PMOS l=0.35u w=2.4u
M4 N005 N026 0 0 NMOS
.model NMOS NMOS
.model PMOS PMOS
.lib standard.mos
.inc library.mod
.param Iref=2u
.tran 40u
* detect falling edge of rectangular wave
* make Sawtooth wave
* XOR
* PWL by using camparaotr
* 5-bit Digital-to-frequency converter
* comparator
* make rectangular wave from oscilator
* For implementing main core  make V3-V7 0v V8 3.3v and add <.step param Iref list 1u 2u 4u 8u 16u 32u
* and check:
*  Rect_signal node for rectangular signal
*  Sawtooth node for sawtooth signal
*  PWL_output for PWL signal
* you can also chec bit converter part by changing v3_v7 voltage source values from 0 to 3.3 by implementing 5bit binar value
* each represents sum(2^n)+2 n activated bits
* System also can be reseted by Reset V8 making low
.backanno
.end

* Results of the author's LTspice run, read from the files saved beside the schematic
* Operating Point, zero values left out:
*   V(vdd) = 3.3 V
*   V(n031) = 503 nV
*   V(rect_signal) = 2.922 V
*   V(n032) = 3.3 V
*   V(n033) = 8.408 nV
*   V(n029) = 795.1 mV
*   V(0_detector) = 301.3 nV
*   V(p_bit_mirror) = 2.506 V
*   V(sawtooth) = 3.3 V
*   V(current_source) = 605.1 mV
*   V(n027) = 974.4 mV
*   V(n028) = 3.3 V
*   V(n034) = 458.8 mV
*   V(n036) = 1.577 V
*   V(n030) = 7.245 nV
*   V(pwl_output) = 3.3 V
*   V(mirror_bits) = 1.49 V
*   V(n009) = 2.506 V
*   V(n015) = 3.3 V
*   V(n010) = 2.506 V
*   V(n016) = 3.3 V
*   V(n011) = 2.506 V
*   V(n017) = 3.3 V
*   V(n012) = 2.506 V
*   V(n018) = 3.3 V
*   V(n013) = 2.506 V
*   V(n019) = 3.3 V
*   V(n006) = 2.328 V
*   V(n005) = 1.474 V
*   V(n021) = 712.4 mV
*   V(n002) = 2.458 V
*   V(n007) = 2.358 V
*   V(n022) = 1.415 V
*   V(n001) = 3.182 V
*   V(n023) = 1.397 V
*   V(n003) = 3.183 V
*   V(n020) = 1.951 V
*   V(n014) = 1.307 V
*   V(n025) = 255.4 mV
*   V(n008) = 2.888 V
*   V(n004) = 1.887 V
*   V(n024) = 1.157 V
*   V(n037) = 7.245 nV
*   V(reset) = 3.3 V
*   V(n026) = 5.705 nV
*   Id(M21) = 128.5 pA
*   Is(M21) = -128.5 pA
*   Id(M23) = 3.364 pA
*   Ib(M23) = -3.31 pA
*   Id(M25) = 3.31 pA
*   Is(M25) = -3.31 pA
*   Id(M30) = 76.98 pA
*   Is(M30) = -76.98 pA
*   Id(M31) = 4.177 pA
*   Ib(M31) = -3.31 pA
*   Id(M40) = 3.31 pA
*   Ib(M40) = -3.779 pA
*   Id(M41) = 298 µA
*   Ib(M41) = -1.453 pA
*   Is(M41) = -298 µA
*   Id(M34) = 172.3 µA
*   Ib(M34) = -1.587 pA
*   Is(M34) = -172.3 µA
*   Id(M33) = 298 µA
*   Is(M33) = -298 µA
*   Id(M45) = 3.345 pA
*   Is(M45) = -3.345 pA
*   Id(M42) = 3.463 pA
*   Ib(M42) = -3.31 pA
*   Id(M48) = 3.463 pA
*   Ib(M48) = -3.31 pA
*   Id(M52) = 3.463 pA
*   Ib(M52) = -3.31 pA
*   Id(M56) = 3.463 pA
*   Ib(M56) = -3.31 pA
*   Id(M60) = 3.463 pA
*   Ib(M60) = -3.31 pA
*   Id(M64) = 3.463 pA
*   Ib(M64) = -3.31 pA
*   Id(M67) = 2 µA
*   Is(M67) = -2 µA
*   Id(M8) = 2.045 µA
*   Ib(M8) = -3.061 pA
*   Is(M8) = -2.045 µA
*   Id(M10) = 2.773 µA
*   Ib(M10) = -3.793 pA
*   Is(M10) = -2.773 µA
*   Id(M16) = 2.764 µA
*   Ib(M16) = -2.891 pA
*   Is(M16) = -2.764 µA
*   Id(M69) = 2.045 µA
*   Is(M69) = -2.045 µA
*   Id(M70) = 2.551 µA
*   Ib(M70) = -1.961 pA
*   Is(M70) = -2.551 µA
*   Id(M75) = 2.773 µA
*   Ib(M75) = -1.425 pA
*   Is(M75) = -2.773 µA
*   Id(M76) = 2.764 µA
*   Ib(M76) = -1.407 pA
*   Is(M76) = -2.764 µA
*   Id(M77) = 52.63 µA
*   Ib(M77) = -1.582 pA
*   Is(M77) = -52.63 µA
*   Id(M81) = 52.63 µA
*   Is(M81) = -52.63 µA
*   Id(M82) = 72.94 µA
*   Ib(M82) = -1.167 pA
*   Is(M82) = -72.94 µA
*   Id(M83) = 81.51 µA
*   Ib(M83) = -2.932 pA
*   Is(M83) = -81.51 µA
*   Id(M3) = 3.345 pA
*   Is(M3) = -3.345 pA
*   Id(M5) = 3.341 pA
*   Is(M5) = -3.341 pA
*   Id(M4) = 1.552 pA
*   Ib(M4) = -1.484 pA
*   Id(M22) = 125.2 pA
*   Ib(M22) = 3.31 pA
*   Is(M22) = -128.5 pA
*   Id(M24) = 3.364 pA
*   Is(M24) = -3.364 pA
*   Ib(M26) = 3.31 pA
*   Is(M26) = -3.31 pA
*   Id(M27) = 71.16 pA
*   Ib(M27) = 5.825 pA
*   Is(M27) = -76.98 pA
*   Id(M28) = 68.64 pA
*   Ib(M28) = 2.515 pA
*   Is(M28) = -71.16 pA
*   Id(M32) = 4.177 pA
*   Is(M32) = -4.177 pA
*   Id(M38) = 3.31 pA
*   Is(M38) = -3.31 pA
*   Id(M39) = 298 µA
*   Ib(M39) = 2.336 pA
*   Is(M39) = -298 µA
*   Ib(M44) = 3.31 pA
*   Is(M44) = -3.345 pA
*   Id(M43) = 3.463 pA
*   Is(M43) = -3.463 pA
*   Id(M46) = -2.412 pA
*   Ib(M46) = 1.608 pA
*   Id(M47) = 2 µA
*   Ib(M47) = 2.624 pA
*   Is(M47) = -2 µA
*   Id(M49) = 3.463 pA
*   Is(M49) = -3.463 pA
*   Ib(M50) = 3.509 pA
*   Is(M50) = -2.705 pA
*   Id(M51) = -2.412 pA
*   Ib(M51) = 1.608 pA
*   Id(M53) = 3.463 pA
*   Is(M53) = -3.463 pA
*   Ib(M54) = 3.509 pA
*   Is(M54) = -2.705 pA
*   Id(M55) = -2.412 pA
*   Ib(M55) = 1.608 pA
*   Id(M57) = 3.463 pA
*   Is(M57) = -3.463 pA
*   Ib(M58) = 3.509 pA
*   Is(M58) = -2.705 pA
*   Id(M59) = -2.412 pA
*   Ib(M59) = 1.608 pA
*   Id(M61) = 3.463 pA
*   Is(M61) = -3.463 pA
*   Ib(M62) = 3.509 pA
*   Is(M62) = -2.705 pA
*   Id(M63) = -2.412 pA
*   Ib(M63) = 1.608 pA
*   Id(M65) = 3.463 pA
*   Is(M65) = -3.463 pA
*   Ib(M66) = 3.509 pA
*   Is(M66) = -2.705 pA
*   Id(M9) = 2.045 µA
*   Ib(M9) = 1.834 pA
*   Is(M9) = -2.045 µA
*   Id(M15) = 2.773 µA
*   Ib(M15) = 1.081 pA
*   Is(M15) = -2.773 µA
*   Id(M68) = 2.764 µA
*   Ib(M68) = 1.963 pA
*   Is(M68) = -2.764 µA
*   Id(M71) = 2.045 µA
*   Is(M71) = -2.045 µA
*   Id(M72) = 2.551 µA
*   Ib(M72) = 1.359 pA
*   Is(M72) = -2.551 µA
*   Id(M73) = 2.773 µA
*   Is(M73) = -2.773 µA
*   Id(M74) = 2.764 µA
*   Is(M74) = -2.764 µA
*   Id(M78) = 52.63 µA
*   Ib(M78) = 2.425 pA
*   Is(M78) = -52.63 µA
*   Id(M79) = 52.63 µA
*   Is(M79) = -52.63 µA
*   Id(M80) = 72.94 µA
*   Ib(M80) = 1.423 pA
*   Is(M80) = -72.94 µA
*   Id(M84) = 81.51 µA
*   Is(M84) = -81.51 µA
*   Id(M1) = 2 µA
*   Is(M1) = -2 µA
*   Ib(M2) = 3.31 pA
*   Is(M2) = -3.345 pA
*   Ib(M6) = 3.31 pA
*   Is(M6) = -3.341 pA
*   I(I2) = 2 µA
*   I(R3) = 172.3 µA
*   I(R4) = 88.5 pA
*   I(R5) = 72.94 µA
*   I(V2) = -689.4 µA